# EAGLE design CANSAT12th (EAGLE 9.6.2)
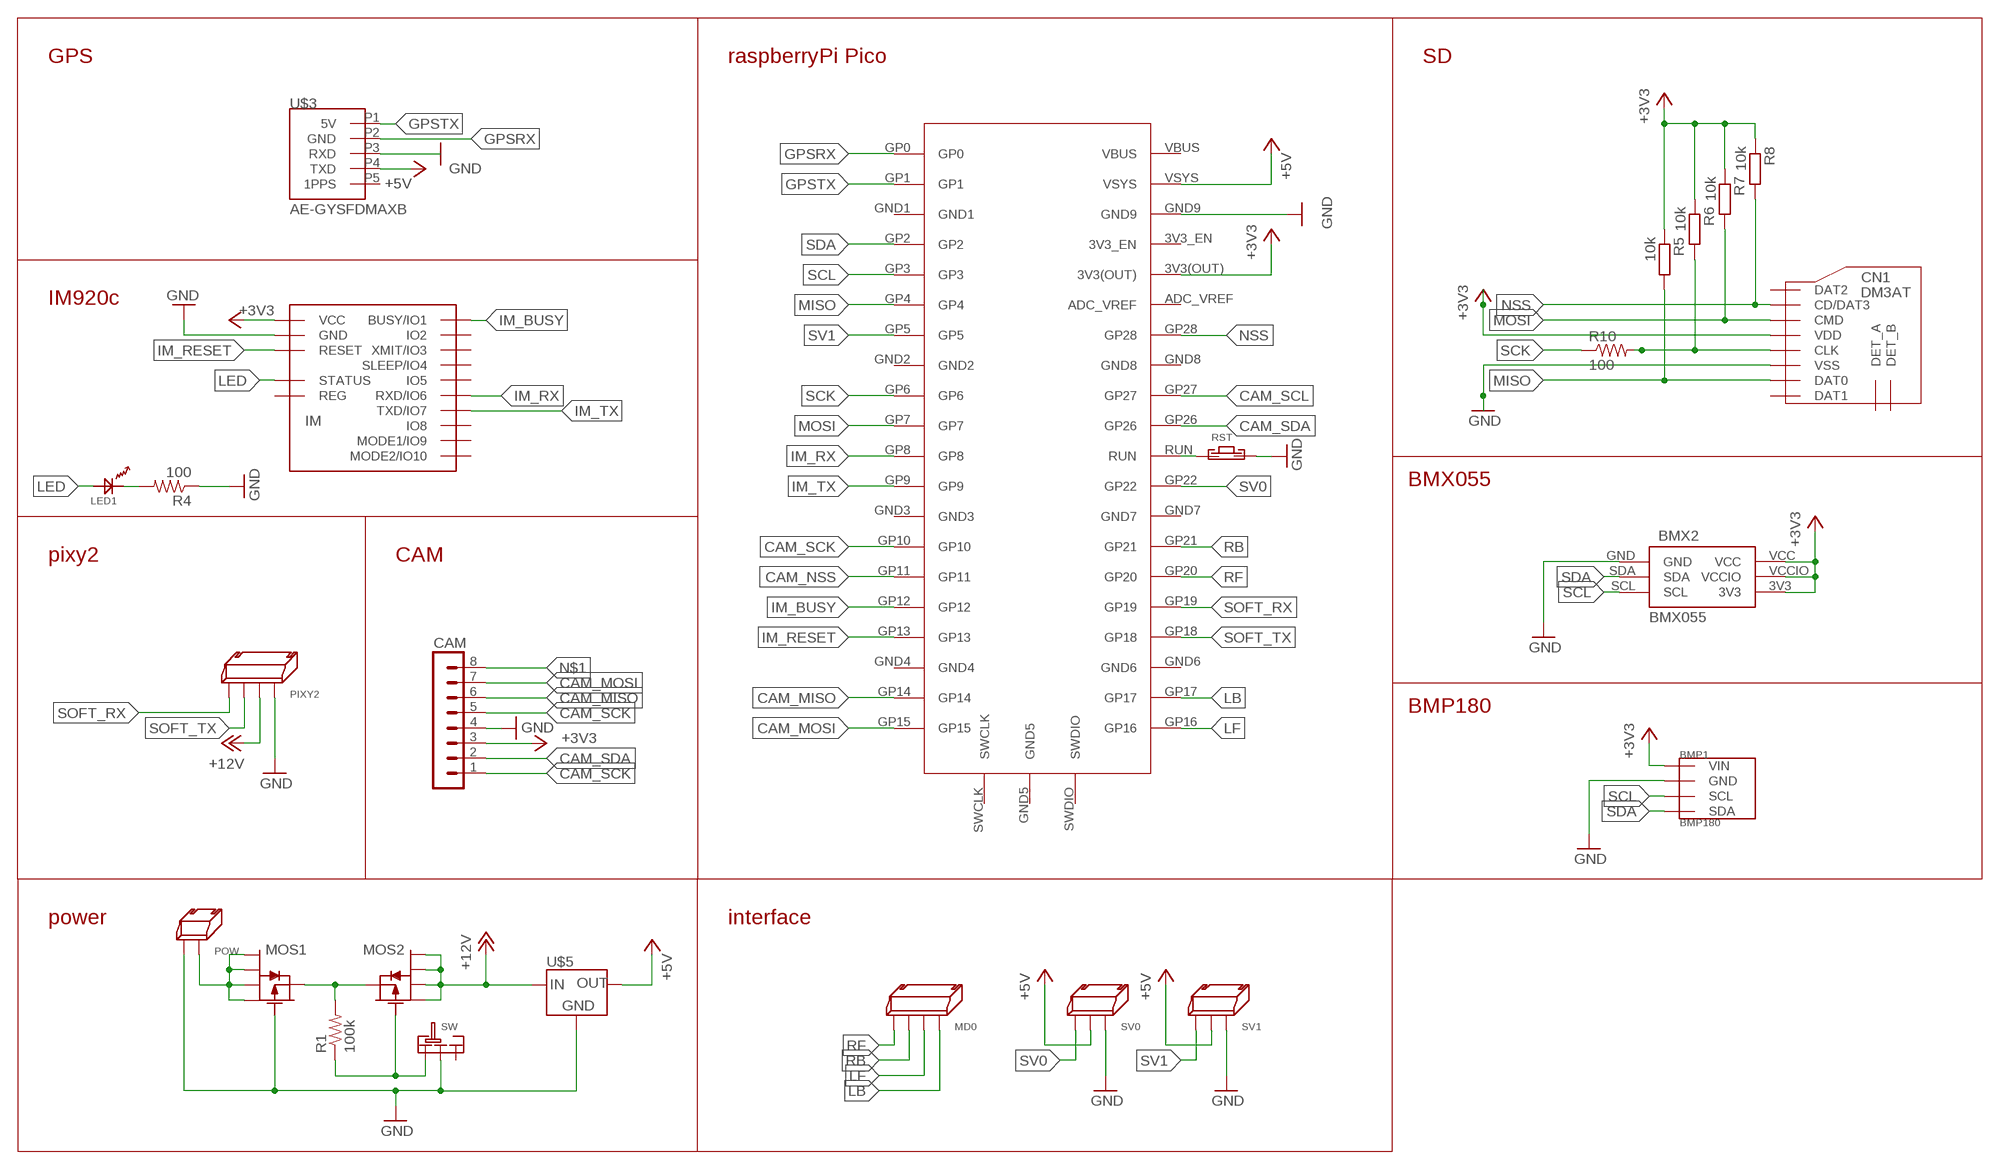
[diagram p0: schematic, sheet 1]

## Parts
BMP1  BMP180  [GY-68]
BMX2  BMX055  [BMX055]
CAM  MA08-1  [MA08-1]
CN1  DM3AT  [DM3AT]
IM  IM920C  [IM920C]
LED1  OSXX1608C1A  [OSXX1608C1A]
MD0  4PIN_SIDE  [4PIN_SIDE]
MOS1  PCH_SSM6J808R  [SSM6J808R]
MOS2  PCH_SSM6J808R  [SSM6J808R]
PIXY2  4PIN_SIDE  [4PIN_SIDE]
POW  2PIN_SIDE  [2PIN_SIDE]
R1  100k  R-US_R0603  [R0603]
R4  100  R-US_R0603  [R0603]
R5  10k  R-EU_R0603  [R0603]
R6  10k  R-EU_R0603  [R0603]
R7  10k  R-EU_R0603  [R0603]
R8  10k  R-EU_R0603  [R0603]
R10  100  R-US_R0603  [R0603]
RST  TVAF06-A020B-R  [TVAF06-A020B-R]
SV0  3PIN_SIDE  [3PIN_SIDE]
SV1  3PIN_SIDE  [3PIN_SIDE]
SW  SRIDE_SWITCH  [SRIDE_SWITCH]
U$1  RASPBERRYPIPICO  [RASPBERRYPIPICO]
U$3  AE-GYSFDMAXB  [AE-GYSFDMAXB]
U$5  LT1117-5  [SOT-223]

## Nets
+3V3: BMP1.P1(VIN) BMX2.3V3 BMX2.VCC BMX2.VCCIO CAM.3 CN1.VDD IM.$P17(VCC) R5.1 R6.1 R7.1 R8.1 U$1.3V3(OUT)
+5V: SV0.P$1 SV1.P$1 U$1.VSYS U$3.P4(TXD) U$5.2(OUT)
+12V: MOS2.1 MOS2.2 MOS2.5 MOS2.6 PIXY2.P$3 U$5.3(IN)
CAM_MISO: CAM.6 U$1.GP14
CAM_MOSI: CAM.7 U$1.GP15
CAM_NSS: U$1.GP11
CAM_SCK: CAM.1 CAM.5 U$1.GP10
CAM_SCL: U$1.GP27
CAM_SDA: CAM.2 U$1.GP26
GND: BMP1.P2(GND) BMX2.GND CAM.4 CN1.VSS IM.$P18(GND) MOS1.3 PIXY2.P$4 POW.P$2 R4.1 RST.P$2 SV0.P$3 SV1.P$3 SW.LR U$5.4(GND)
GND1: U$3.P3(RXD) ; supply symbol labelled GND
GPSRX: U$1.GP0 U$3.P2(GND)
GPSTX: U$1.GP1 U$3.P1(5V)
IM_BUSY: IM.$P1(BUSY/IO1) U$1.GP12
IM_RESET: IM.$P19(RESET) U$1.GP13
IM_RX: IM.$P6(RXD/IO6) U$1.GP8
IM_TX: IM.$P7(TXD/IO7) U$1.GP9
LB: MD0.P$4 U$1.GP17
LED: IM.$P15(STATUS) LED1.AN
LF: MD0.P$3 U$1.GP16
MISO: CN1.DAT0 R5.2 U$1.GP4
MOSI: CN1.CMD R7.2 U$1.GP7
N$1: CAM.8
N$2: RST.P$1 U$1.RUN
N$3: LED1.CT R4.2
N$4: U$1.GND9 ; supply symbol labelled GND
N$6: MOS1.4 MOS2.4 R1.2
N$7: MOS2.3 R1.1 SW.L
N$8: MOS1.1 MOS1.2 MOS1.5 MOS1.6 POW.P$1
NSS: CN1.CD/DAT3 R8.2 U$1.GP28
RB: MD0.P$1 U$1.GP21
RF: MD0.P$2 U$1.GP20
SCK: CN1.CLK R6.2 R10.1 R10.2 U$1.GP6
SCL: BMP1.P3(SCL) BMX2.SCL U$1.GP3
SDA: BMP1.P4(SDA) BMX2.SDA U$1.GP2
SOFT_RX: PIXY2.P$2 U$1.GP19
SOFT_TX: PIXY2.P$1 U$1.GP18
SV0: SV0.P$2 U$1.GP22
SV1: SV1.P$2 U$1.GP5
Unconnected: CN1.DAT1 CN1.DAT2 CN1.DET_A CN1.DET_B IM.$P2(IO2) IM.$P3(XMIT/IO3) IM.$P4(SLEEP/IO4) IM.$P5(IO5) IM.$P8(IO8) IM.$P9(MODE1/IO9) IM.$P10(MODE2/IO10) IM.$P16(REG) SW.R U$1.3V3_EN U$1.ADC_VREF U$1.GND1 U$1.GND2 U$1.GND3 U$1.GND4 U$1.GND5 U$1.GND6 U$1.GND7 U$1.GND8 U$1.SWCLK U$1.SWDIO U$1.VBUS U$3.P5(1PPS)

## Notes on the sheet
- GPS | raspberryPi Pico | SD
- IM920c
- BMX055
- pixy2 | CAM
- BMP180
- power | interface

## Library data of the parts
BMP1 = BMP180:BMP180
BMX2 = BMX055:BMX055
CAM = con-lstb:MA08-1: PIN HEADER; OC_FARNELL: unknown; OC_NEWARK: unknown
CN1 = microSD:DM3AT
IM = IM920:IM920C
LED1 = Chip LED:OSXX1608C1A
MD0 PIXY2 = XR Connector:4PIN_SIDE
MOS1 MOS2 = Chip MOSFET:PCH_SSM6J808R
POW = XR Connector:2PIN_SIDE
R1 R4 R10 = rcl:R-US_: RESISTOR, American symbol; SPICEPREFIX: R
R5-R8 = rcl:R-EU_: RESISTOR, European symbol; SPICEPREFIX: R
RST = Tact switch:TVAF06-A020B-R
SV0 SV1 = XR Connector:3PIN_SIDE
SW = Sride Switch:SRIDE_SWITCH
U$1 = Raspberry Pi Pico:RASPBERRYPIPICO
U$3 = AE-GYSFDMAXB:AE-GYSFDMAXB
U$5 = LT1117:LT1117-5

## Net classes
2 GND_+12V: width 0.305 mm

## Board
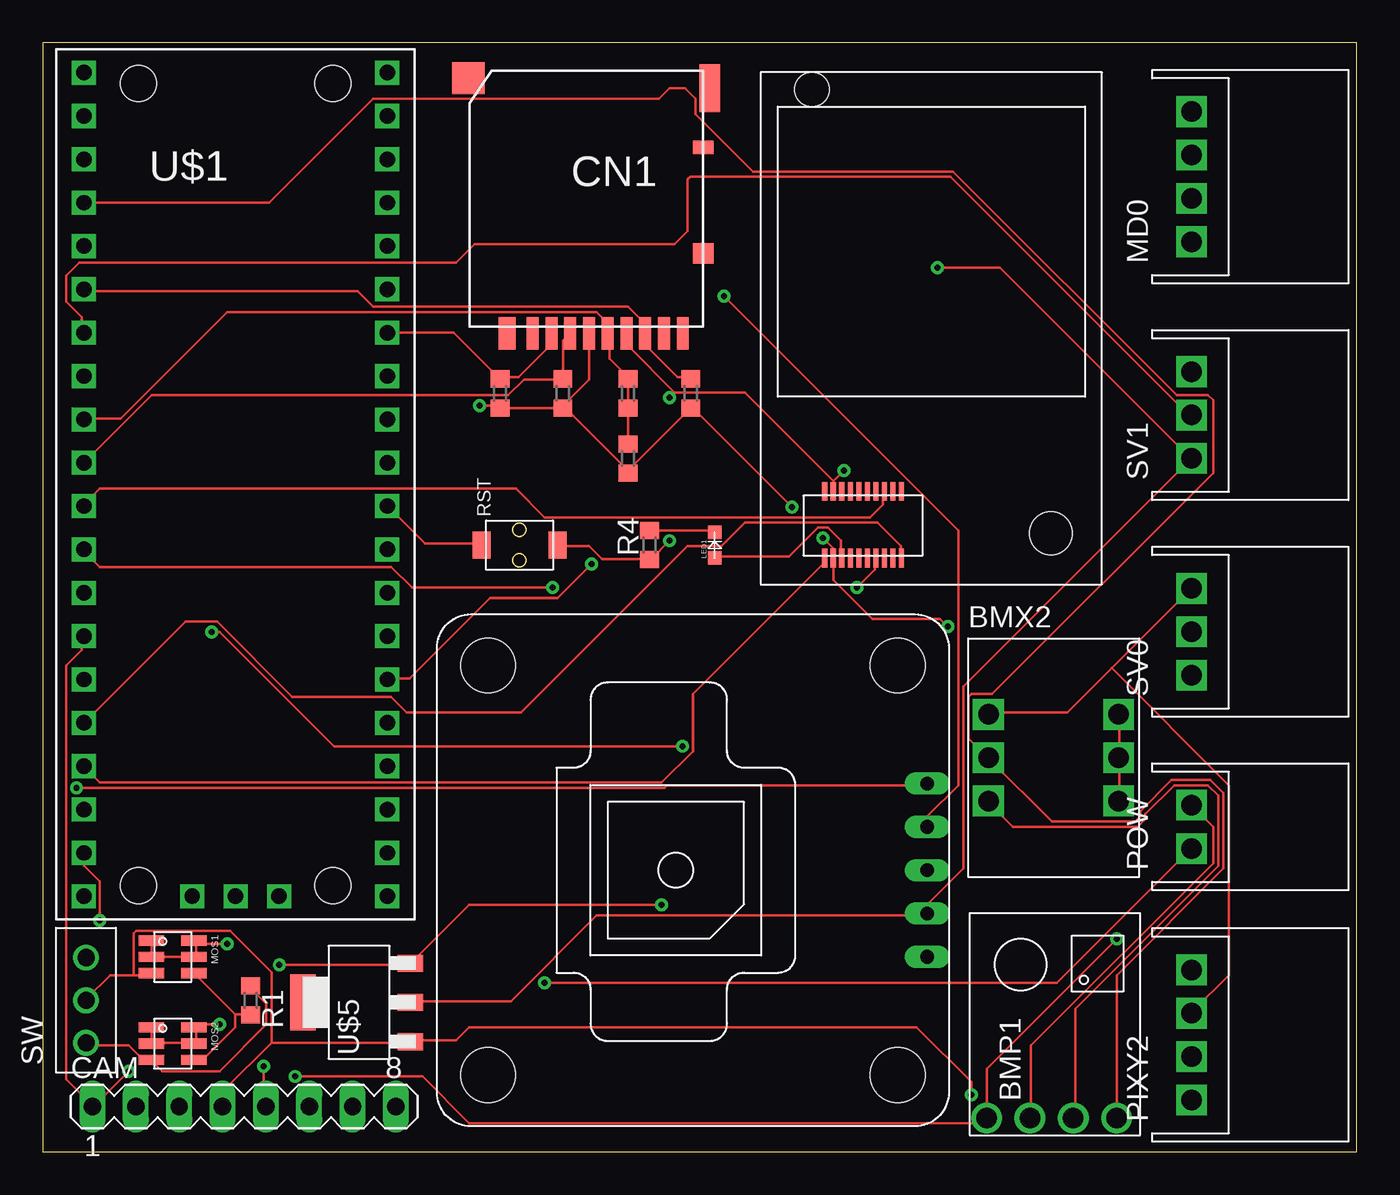
[diagram p1: board, top side]
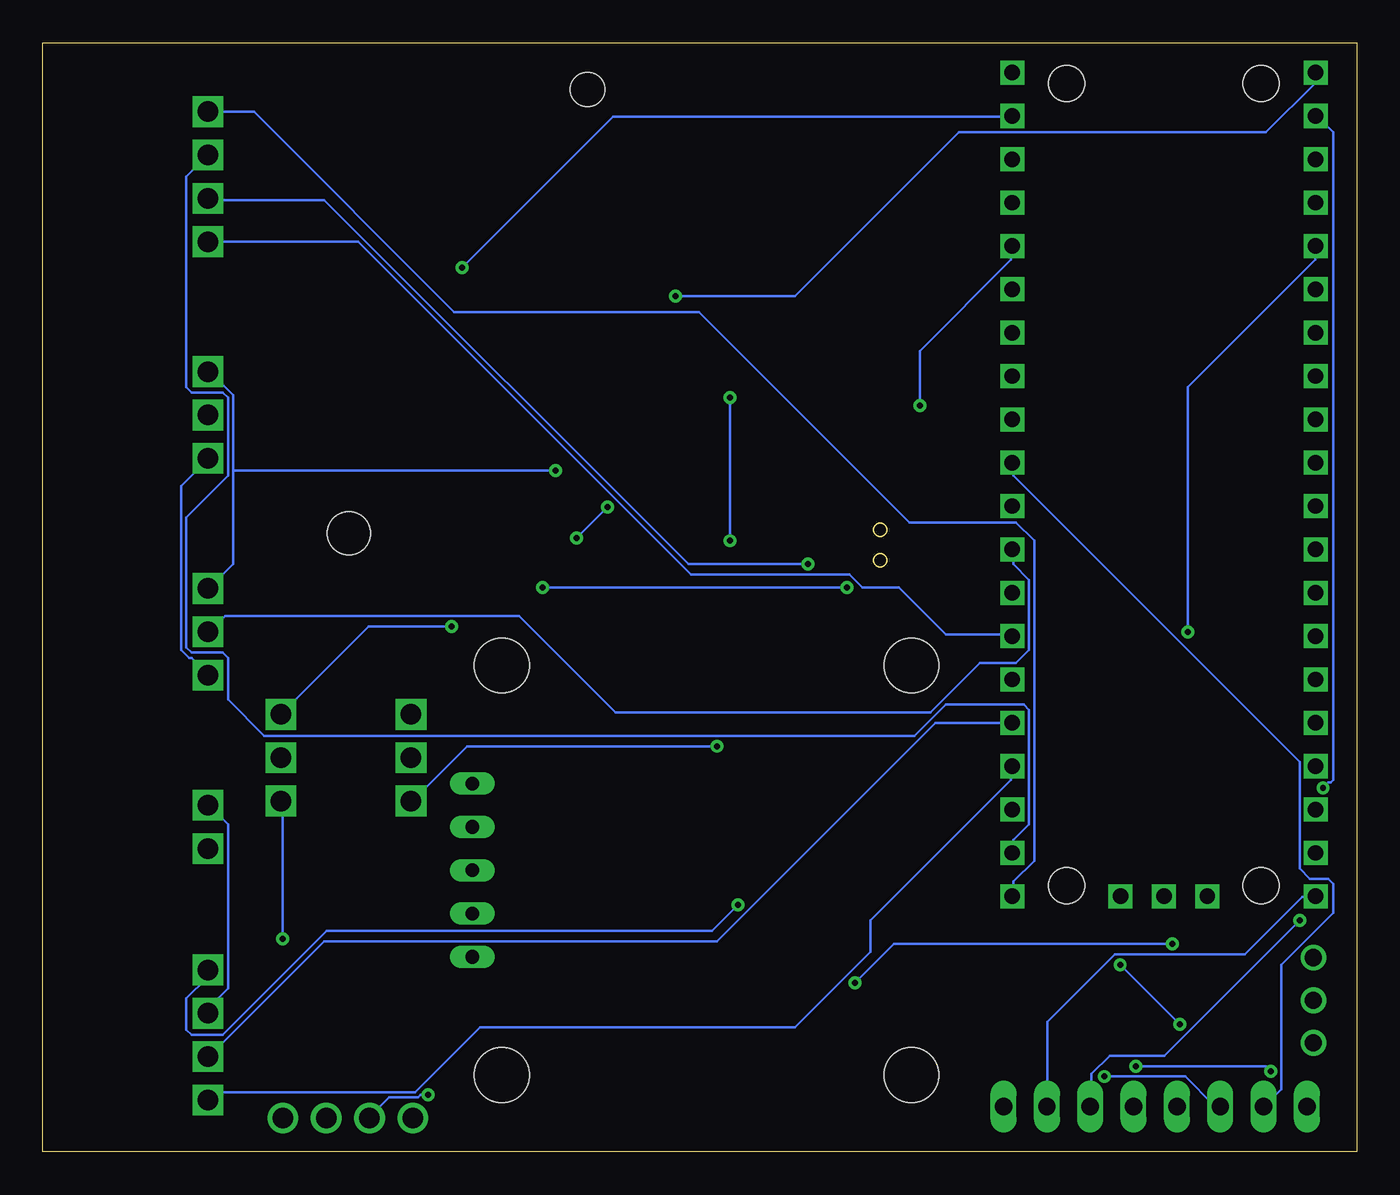
[diagram p2: board, bottom side, seen from below]

Size 77 x 65 mm. Coordinates in mm from the lower left corner, seen from the top.
Outline: 0,0 77,0 77,65 0,65 0,0
Copper layers (1*16): Top 0.035mm / dielectric 1.5mm / Bottom 0.035mm
Design rules "default": minimum track width 6mil, minimum drill 0.35mm, track to track 6mil, track to pad 6mil, pad to pad 6mil, via to via 6mil, smd to smd 6mil, copper to edge 40mil, drill to drill 6mil, minimum pad ring 10mil, minimum via ring 8mil, stop-mask expansion 4mil, vias tented up to drill 0mil, thermal gap 10mil

### Footprints (pad centres in the part's own frame; a part is rotated, then mirrored left to right if it is on the bottom)
GY-68 = drill 1.2: P1 -5,4; P2 -5,1.46; P3 -5,-1.08; P4 -5,-3.62
BMX055 = drill 1.2 pad 1.5 square: 3V3 8.81,-9.53; GND 1.19,-4.46; SCL 1.19,-9.53; SDA 1.19,-7; VCC 8.81,-4.46; VCCIO 8.81,-7
MA08-1 = drill 1.016 long: 1 -8.89,0; 2 -6.35,0; 3 -3.81,0; 4 -1.27,0; 5 1.27,0; 6 3.81,0; 7 6.35,0; 8 8.89,0
DM3AT = smd 0.7 x 1.9: CD/DAT3 2.2,6.4; CLK -1.1,6.4; CMD 1.1,6.4; DAT0 -3.3,6.4; DAT1 -4.4,6.4; DAT2 3.3,6.4; DET_B -5.5,6.4; VDD 0,6.4; VSS -2.2,6.4 | smd 1.2 x 0.8: DET_A -6.7,-4.5 | smd 1 x 1.9: P$9 4.8,6.381 | smd 1.2 x 1.2: P$11 -6.7,1.7 | smd 1.2 x 2.8: P$13 -7.081,-7.973 | smd 1.9 x 1.9: P$14 7.054,-8.562
IM920C = smd 0.3 x 1.1: $P1 -1.75,-13.45; $P2 -1.75,-9.55; $P3 -2.25,-13.45; $P4 -2.25,-9.55; $P5 -2.75,-13.45; $P6 -2.75,-9.55; $P7 -3.25,-13.45; $P8 -3.25,-9.55; $P9 -3.75,-13.45; $P10 -3.75,-9.55; $P11 -4.25,-13.45; $P12 -4.25,-9.55; $P13 -4.75,-13.45; $P14 -4.75,-9.55; $P15 -5.25,-13.45; $P16 -5.25,-9.55; $P17 -5.75,-13.45; $P18 -5.75,-9.55; $P19 -6.25,-13.45; $P20 -6.25,-9.55 | hole 2.5: 7,-12 | hole 2: -7,14
OSXX1608C1A = smd 0.8 x 0.8: AN -0.75,0; CT 0.75,0
4PIN_SIDE = drill 1.2 square: P$1 -3.81,0; P$2 -1.27,0; P$3 3.81,0; P$4 1.27,0
SSM6J808R = smd 0.6 x 1.5: 1 -0.95,-1.25; 2 0,-1.25; 3 0.95,-1.25; 4 0.95,1.25; 5 0,1.25; 6 -0.95,1.25
2PIN_SIDE = drill 1.2 square: P$1 -1.27,0; P$2 1.27,0
R0603 = smd 1 x 1.1: 1 -0.85,0; 2 0.85,0
TVAF06-A020B-R = smd 1.6 x 1.05: P$1 0,2.225; P$2 0,-2.225
3PIN_SIDE = drill 1.2 square: P$1 -2.54,0; P$2 0,0; P$3 2.54,0
SRIDE_SWITCH = drill 1: L -2.5,0; LR 0,0; R 2.5,0
RASPBERRYPIPICO = drill 0.9 square: 3V3(OUT) 8.89,13.97; 3V3_EN 8.89,16.51; ADC_VREF 8.89,11.43; GND1 -8.89,19.05; GND2 -8.89,6.35; GND3 -8.89,-6.35; GND4 -8.89,-19.05; GND5 0,-24.13; GND6 8.89,-19.05; GND7 8.89,-6.35; GND8 8.89,6.35; GND9 8.89,19.05; GP0 -8.89,24.13; GP1 -8.89,21.59; GP2 -8.89,16.51; GP3 -8.89,13.97; GP4 -8.89,11.43; GP5 -8.89,8.89; GP6 -8.89,3.81; GP7 -8.89,1.27; GP8 -8.89,-1.27; GP9 -8.89,-3.81; GP10 -8.89,-8.89; GP11 -8.89,-11.43; GP12 -8.89,-13.97; GP13 -8.89,-16.51; GP14 -8.89,-21.59; GP15 -8.89,-24.13; GP16 8.89,-24.13; GP17 8.89,-21.59; GP18 8.89,-16.51; GP19 8.89,-13.97; GP20 8.89,-11.43; GP21 8.89,-8.89; GP22 8.89,-3.81; GP26 8.89,1.27; GP27 8.89,3.81; GP28 8.89,8.89; RUN 8.89,-1.27; SWCLK -2.54,-24.13; SWDIO 2.54,-24.13; VBUS 8.89,24.13; VSYS 8.89,21.59 | hole 2.1: -5.7,23.5; 5.7,23.5; -5.7,-23.5; 5.7,-23.5
AE-GYSFDMAXB = drill 0.8 long: P1 13.716,5.08; P2 13.716,2.54; P3 13.716,0; P4 13.716,-2.54; P5 13.716,-5.08 | hole 3.2: -12,12; 12,12; 12,-12; -12,-12
SOT-223 = smd 3.3 x 1.5: 1 0,3.3 | smd 1 x 1.5: 2 0,-3; 3 2.3,-3; 4 -2.3,-3

### Placement (x,y rotation side)
BMP1  59.31,6.99 90 top
BMX2  54.23,30.1 0 top
CAM  11.81,2.67 0 top
CN1  32,54.36 180 top
IM  52.07,48.26 0 top
LED1  39.37,35.56 90 top
MD0  67.31,57.15 90 top
MOS1  7.62,11.43 270 top
MOS2  7.62,6.35 270 top
PIXY2  67.31,6.86 90 top
POW  67.31,19.05 90 top
R1  12.19,8.89 270 top
R4  35.56,35.56 90 top
R5  37.97,44.45 90 top
R6  34.29,40.64 90 top
R7  30.48,44.45 90 top
R8  26.8,44.45 90 top
R10  34.29,44.45 90 top
RST  27.94,35.56 90 top
SV0  67.31,30.48 90 top
SV1  67.31,43.18 90 top
SW  2.54,8.89 90 top
U$1  11.3,39.12 0 top
U$3  38.1,16.51 0 top
U$5  18.54,8.76 90 top

### Tracks (layer width: path | path; a pad name or v marks a point on that pad's centre or on a via)
+3V3  (via drill 0.35)
  Top 0.152: v14.78,4.42 22.25,4.42 24.99,1.68 54.86,1.68 55.17,1.98 BMP1.P1 55.32,2.13 55.32,4.88 v62.94,12.5 | 34.29,39.93 37.95,43.59 R5.1 38.1,43.59 v43.89,37.8 | CN1.VDD 32,45.26 30.48,43.74 | v25.6,43.74 26.67,43.74 R8.1 26.82,43.59 30.48,43.59 R7.1 30.48,43.74 | 30.48,43.74 34.29,39.93 | 34.29,39.93 R6.1 | BMX2.3V3 63.09,20.57 63.09,23.01 BMX2.VCCIO 63.09,23.16 63.09,25.6 BMX2.VCC | v53.03,30.79 52.58,31.24 48.62,31.24 46.33,33.53 46.33,34.75 IM.$P17 46.33,34.9 46.33,35.36 v45.72,35.97
  Bottom 0.152: v14.78,4.42 10.06,4.42 8.38,2.74 8.08,2.74 CAM.3 | v25.6,43.74 25.6,46.94 20.27,52.27 20.27,53.03 U$1.3V3(OUT) | v53.03,30.79 57.91,30.79 62.94,25.76 BMX2.VCC | v45.72,35.97 v43.89,37.8 | v62.94,12.5 62.94,20.42 BMX2.3V3
+5V  (via drill 0.35)
  Top 0.152: U$5.2 21.64,8.84 27.43,8.84 32.46,13.87 51.82,13.87 U$3.P4 51.82,14.48 53.95,16.61 53.95,27.28 SV1.P$1 67.21,40.69 56.08,51.82 v52.43,51.82
  Bottom 0.152: v52.43,51.82 43.59,60.66 20.27,60.66 U$1.VSYS | SV0.P$1 67.36,28.04 68.28,28.96 68.43,28.96 68.89,29.41 68.89,39.01 67.36,40.54 SV1.P$1
+12V  (via drill 0.35)
  Top 0.152: 6.4,6.4 6.4,7.16 MOS2.1 | v13.87,10.97 21.49,10.97 U$5.3 21.64,11.12 24.99,14.48 v36.27,14.48 | v10.36,7.47 9.14,7.47 8.99,7.32 MOS2.6 8.99,7.16 8.99,6.4 MOS2.5 8.84,6.4 6.4,6.4 | 6.4,6.4 MOS2.2
  Bottom 0.152: v10.36,7.47 v13.87,10.97 | v36.27,14.48 37.8,12.95 60.35,12.95 66.45,6.86 68.28,6.86 68.58,7.16 68.58,8.99 67.36,10.21 67.36,10.67 PIXY2.P$3
CAM_MISO  (via drill 0.35)
  Top 0.152: v3.35,13.56 3.35,15.85 2.44,16.76 2.44,17.53 U$1.GP14
  Bottom 0.152: v3.35,13.56 11.28,5.64 14.48,5.64 15.54,4.57 15.54,2.74 CAM.6
CAM_MOSI
  Bottom 0.152: U$1.GP15 2.44,14.94 3.2,14.94 6.55,11.58 14.17,11.58 18.14,7.62 18.14,2.74 CAM.7
CAM_SCK  (via drill 0.35)
  Top 0.152: U$1.GP10 2.29,30.18 2.29,29.41 1.37,28.5 1.37,4.27 2.9,2.74 CAM.1 3.05,2.74 v5.03,4.72 | v12.95,5.03 12.95,2.74 CAM.5
  Bottom 0.152: v12.95,5.03 5.33,5.03 v5.03,4.72
CAM_SDA
  Bottom 0.152: U$1.GP26 20.12,40.39 20.12,39.62 3.35,22.86 3.35,16.61 2.74,16 1.68,16 1.37,15.7 1.37,14.02 4.42,10.97 4.42,3.66 5.33,2.74 CAM.2
GND  (via drill 0.35)
  Top 0.152: RST.P$2 30.18,35.51 32,35.51 32.77,34.75 35.51,34.75 R4.1 35.66,34.75 v36.73,35.81 | 46.33,39.32 46.33,38.86 IM.$P18 | 46.33,39.32 41.15,44.5 37.03,44.5 | 37.03,44.5 34.29,47.24 34.29,47.85 CN1.VSS | 37.03,44.5 v36.73,44.2 | SV0.P$3 62.64,28.35 | 62.64,28.35 60.05,25.76 55.47,25.76 BMX2.GND | v46.94,39.93 46.33,39.32 | 5.33,10.36 3.96,10.36 2.59,8.99 SW.LR | 5.33,10.36 6.25,10.36 MOS1.3 | 13.41,6.4 21.49,6.4 U$5.4 21.64,6.55 24.23,6.55 24.99,7.32 51.21,7.32 54.41,4.12 v54.41,3.35 | 13.41,6.4 10.67,3.66 10.67,2.74 CAM.4 | 5.33,10.36 5.33,12.8 5.49,12.95 10.97,12.95 13.41,10.52 13.41,6.4 | POW.P$2 68.58,19.05 68.58,16.92 57.91,6.25 57.91,2.13 BMP1.P2 | 62.64,28.35 69.49,21.49 69.49,10.36 67.36,8.23 PIXY2.P$4
  Bottom 0.152: v36.73,44.2 v36.73,35.81 | 65.84,39.93 65.84,34.44 67.21,33.07 SV0.P$3 | 65.84,39.93 65.84,44.35 67.21,45.72 SV1.P$3 | 65.84,39.93 v46.94,39.93 | PIXY2.P$4 67.21,8.23 67.21,8.53 66.14,9.6 66.14,19.2 67.21,20.27 POW.P$2 | v54.41,3.35 54.86,3.35 55.02,3.2 56.69,3.2 57.76,2.13 BMP1.P2
GPSRX  (via drill 0.35)
  Top 0.152: U$3.P2 51.82,19.66 53.65,21.49 53.65,36.42 v39.93,50.14
  Bottom 0.152: v39.93,50.14 32.92,50.14 23.32,59.74 5.33,59.74 2.44,62.64 2.44,63.25 U$1.GP0
GPSTX  (via drill 0.35)
  Top 0.152: v1.98,21.34 36.42,21.34 36.58,21.49 51.82,21.49 U$3.P1
  Bottom 0.152: v1.98,21.34 1.68,21.64 1.52,21.64 1.37,21.79 1.37,59.74 2.29,60.66 U$1.GP1
IM_BUSY
  Top 0.152: IM.$P1 50.29,34.9 50.29,35.51 48.92,36.88 41.15,36.88 39.78,35.51 37.8,35.51 28.04,25.76 21.34,25.76 20.42,26.67 14.63,26.67 10.21,31.09 8.38,31.09 2.44,25.15 U$1.GP12
IM_RESET
  Top 0.152: IM.$P19 45.72,34.75 45.72,34.44 38.1,26.82 38.1,23.47 36.27,21.64 3.35,21.64 2.44,22.55 U$1.GP13
IM_RX
  Top 0.152: IM.$P6 49.23,38.71 49.23,37.95 48.46,37.19 29.41,37.19 27.74,38.86 3.35,38.86 2.44,37.95 U$1.GP8
IM_TX  (via drill 0.35)
  Top 0.152: v47.7,33.07 48.77,34.14 48.77,34.75 IM.$P7 | v29.87,33.07 21.64,33.07 20.42,34.29 3.35,34.29 2.44,35.2 U$1.GP9
  Bottom 0.152: v29.87,33.07 v47.7,33.07
LB
  Bottom 0.152: MD0.P$4 68.58,57.15 68.58,44.81 68.28,44.5 66.45,44.5 66.14,44.2 66.14,39.62 68.58,37.19 68.58,29.57 68.28,29.26 66.45,29.26 66.14,28.96 66.14,26.52 64.01,24.38 25.91,24.38 24.08,26.21 19.51,26.21 19.2,25.91 19.2,19.2 20.12,18.29 20.12,17.53 U$1.GP17
LED
  Top 0.152: LED1.AN 39.47,34.9 43.74,34.9 45.41,36.58 46.02,36.58 46.79,35.81 46.79,34.9 IM.$P15
LF
  Bottom 0.152: MD0.P$3 64.62,60.96 52.88,49.23 38.56,49.23 26.21,36.88 19.96,36.88 18.9,35.81 18.9,17.07 20.12,15.85 20.12,15.09 U$1.GP16
MISO
  Top 0.152: R5.2 37.95,45.41 37.19,45.41 35.36,47.24 35.36,47.85 CN1.DAT0 35.2,48.01 35.2,48.62 34.29,49.53 19.36,49.53 18.44,50.44 2.44,50.44 U$1.GP4
MOSI
  Top 0.152: CN1.CMD 30.79,47.85 30.48,47.55 R7.2 30.48,45.26 28.19,45.26 27.28,44.35 6.4,44.35 2.44,40.39 U$1.GP7
N$2
  Top 0.152: RST.P$1 25.6,35.66 22.4,35.66 20.27,37.8 U$1.RUN
N$3
  Top 0.152: LED1.CT 39.32,36.42 35.66,36.42 R4.2
N$6
  Top 0.152: 11.28,8.08 12.19,8.08 R1.2 | 11.28,8.08 8.99,10.36 MOS1.4 | 11.28,8.08 11.28,7.32 9.45,5.49 8.99,5.49 MOS2.4
N$7
  Top 0.152: R1.1 12.19,9.6 13.11,8.69 13.11,7.47 10.36,4.72 7.01,4.72 6.4,5.33 MOS2.3 6.25,5.49 5.79,5.49 5.03,6.25 2.59,6.25 SW.L
N$8  (via drill 0.35)
  Top 0.152: 6.4,11.43 6.4,12.34 MOS1.1 | 8.99,12.19 8.99,12.34 MOS1.6 8.99,12.19 | 8.99,12.19 8.99,11.43 MOS1.5 6.4,11.43 | 6.4,11.43 MOS1.2 | v10.82,12.19 8.99,12.19 | v29.41,9.91 59.44,9.91 POW.P$1
  Bottom 0.152: v10.82,12.19 27.13,12.19 v29.41,9.91
NSS
  Top 0.152: CN1.CD/DAT3 29.72,47.85 29.72,47.24 27.89,45.41 26.82,45.41 R8.2 26.67,45.41 24.08,48.01 U$1.GP28
RB
  Bottom 0.152: MD0.P$1 58.52,53.34 39.01,33.83 29.72,33.83 28.96,33.07 26.82,33.07 24.08,30.33 20.27,30.33 U$1.GP21
RF  (via drill 0.35)
  Top 0.152: v32.16,34.44 30.18,32.46 26.21,32.46 21.49,27.74 20.27,27.74 U$1.GP20
  Bottom 0.152: v32.16,34.44 39.17,34.44 60.5,55.78 67.21,55.78 MD0.P$2
SCK
  Top 0.152: R6.2 R10.1 R10.2 34.29,45.41 33.22,46.48 33.22,47.85 CN1.CLK 33.07,48.01 33.07,48.62 32.46,49.23 10.82,49.23 4.57,42.98 2.44,42.98 U$1.GP6
SCL  (via drill 0.35)
  Top 0.152: v9.91,30.48 10.36,30.48 17.07,23.77 v37.49,23.77 | BMP1.P3 60.5,2.13 60.5,8.38 68.89,16.76 68.89,20.88 68.28,21.49 66.29,21.49 64.62,19.81 64.62,19.51 64.16,19.05 56.84,19.05 55.47,20.42 BMX2.SCL
  Bottom 0.152: v9.91,30.48 9.91,44.81 2.44,52.27 2.44,53.03 U$1.GP3 | v37.49,23.77 52.12,23.77 55.32,20.57 BMX2.SCL
SDA
  Top 0.152: U$1.GP2 13.26,55.63 19.36,61.72 36.12,61.72 36.73,62.33 37.64,62.33 38.25,61.72 38.25,60.81 41.6,57.45 53.34,57.45 66.45,44.35 68.28,44.35 68.58,44.04 68.58,39.78 55.63,26.82 54.41,26.82 54.25,26.67 54.25,24.23 55.32,23.16 BMX2.SDA 55.47,23.01 59.13,19.36 64.01,19.36 64.31,19.66 64.31,19.96 66.14,21.79 68.43,21.79 69.19,21.03 69.19,16.61 62.94,10.36 62.94,2.13 BMP1.P4
SOFT_RX
  Bottom 0.152: U$1.GP19 24.69,25.15 37.49,12.34 60.5,12.34 67.21,5.64 PIXY2.P$2
SOFT_TX
  Bottom 0.152: U$1.GP18 20.27,22.55 20.27,21.79 28.5,13.56 28.5,11.73 32.92,7.32 51.36,7.32 55.17,3.5 66.75,3.5 67.21,3.05 PIXY2.P$1
SV0
  Bottom 0.152: U$1.GP22 20.12,35.2 20.12,34.44 19.2,33.53 19.2,29.41 19.96,28.65 22.1,28.65 24.99,25.76 43.43,25.76 49.07,31.39 66.29,31.39 67.21,30.48 SV0.P$2
SV1
  Top 0.152: U$1.GP5 2.29,48.01 2.29,48.92 1.37,49.84 1.37,51.36 2.13,52.12 24.23,52.12 25.3,53.19 37.03,53.19 37.8,53.95 37.8,57 37.95,57.15 53.19,57.15 67.21,43.13 SV1.P$2